# Altium schematic sheet Tag_Lastmodulation_Primär.SchDoc
size A4; SheetNumber: 8; SheetTotal: 8
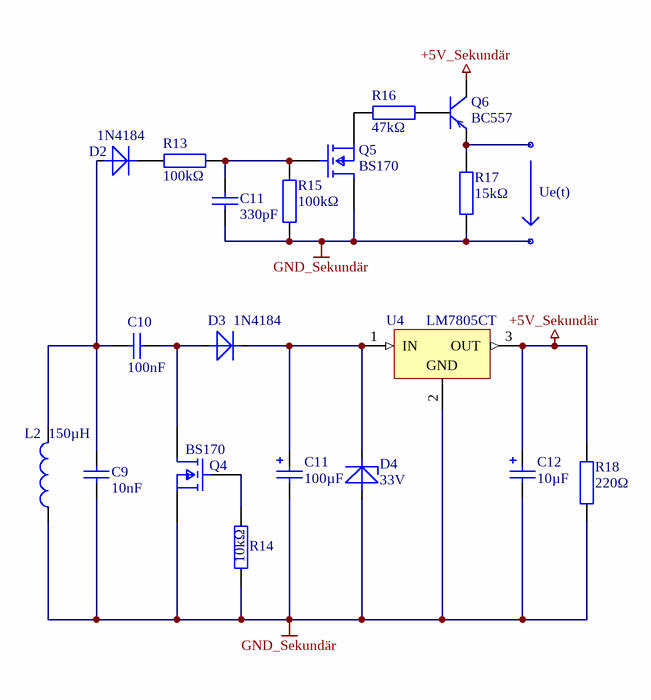
[diagram p0: Tag_Lastmodulation_Primär.SchDoc]

## Parts
(Parts that share a designator on the sheet are numbered #1, #2 ... from top to bottom, then left to right.)
*  Ue(t)
C9  value 10nF  [rad-7.2/2.5/5]  (hidden comment: KO)
C10  value 100nF  [rad-7.2/2.5/5]  (hidden comment: KO)
C11#1  value 330pF  [rad-7.2/2.5/5]  (hidden comment: KO)
C11#2  value 100µF  [RB-.1/.2]  (hidden comment: ELKO)
C12  value 10µF  [RB-.1/.2]  (hidden comment: ELKO)
D2  1N4184  [DIODE-0.6]
D3  1N4184  [DIODE-0.6]
D4  33V  [DIODE-0.4]
L2  value 150µH  (hidden comment: Inductor)
Q4  BS170  [FP-SOT23-IPC_A]
Q5  BS170  [FP-SOT23-IPC_A]
Q6  BC557  [TO-92/EBC]
R13  value 100kΩ  [Axial-0.4]  (hidden comment: RES)
R14  value 10kΩ  [Axial-0.4]  (hidden comment: RES)
R15  value 100kΩ  [Axial-0.4]  (hidden comment: RES)
R16  value 47kΩ  [Axial-0.4]  (hidden comment: RES)
R17  value 15kΩ  [Axial-0.4]  (hidden comment: RES)
R18  value 220Ω  [Axial-0.4]  (hidden comment: RES)
U4  LM7805CT  [FAIR-TO-220-3]

## Nets
+5V_Sekundär: C12.1 Q6.3(C) R18.2 U4.3(OUT)
GND_Sekundär: C9.1 C11#1.2 C11#2.2 C12.2 D4.1(A) L2.2 Q4.2(S) Q5.3(D) R14.1 R15.2 R17.2 R18.1 U4.2(GND)
NetC9_2: C9.2 C10.2 D2.1(A) L2.1
NetC10_1: C10.1 D3.1(A) Q4.3(D)
NetC11#1_1: C11#1.1 Q5.G1(G) R13.1 R15.1
NetC11#2_1: C11#2.1 D3.2(K) D4.2(K) U4.1(IN)
NetD2_2: D2.2(K) R13.2
NetQ4_G1: Q4.G1(G) R14.2
NetQ5_2: Q5.2(S) R16.2
NetQ6_1: Q6.1(B) R16.1
NetQ6_2: Q6.2(E) R17.1

## Library data of the parts
* = Spannungs_kleiner
C9 C10 C11#1 = KO: Kondensator
D2 D3 = DIODE
D4 = Z-DIODE
L2 = Inductor: SimulationGenericComponent: True
Q4 Q5 = CMP-12801-000064-2: MOSFET N-CH 60V .15MA SOT23-3; On-State Resistance: 5R; Continuous Drain Current (ID): 150mA; Threshold Voltage: 3V; Number of Channels: 1; Gate to Source Voltage (Vgs): 20V; Turn-On Delay Time: 10ns; Power Dissipation: 330mW; Element Configuration: Single; Input Capacitance: 60pF; Weight: 0.000282oz; Height: 1mm; Max Operating Temperature: 150°C; Dual Supply Voltage: 60V; Termination: SMD/SMT; Number of Pins: 3; Number of Elements: 1; Mount: Surface Mount; Min Operating Temperature: -55°C; Nominal Vgs: 3V; Width: 1.4mm; Drain to Source Breakdown Voltage: 60V; Turn-Off Delay Time: 10ns; Case/Package: SOT-23; REACH SVHC: No SVHC; Packaging: Tape and Reel; Length: 3.05mm; Max Power Dissipation: 330mW; Rds On Max: 5R; Lead Free: Lead Free; Contact Plating: Tin; Drain to Source Resistance: 5R; Drain to Source Voltage (Vdss): 60V; Package Quantity: 3000; Current Rating: 150mA; Voltage Rating (DC): 60V
Q6 = PNP: Transistor
R13-R18 = RES: Widerstand
U4 = CMP-2000-04938-1: Positive Voltage Regulator, 5 V, 1 A, -40 to 125 degC, 3-Pin TO-220, RoHS, Tube; Manufacturer: FairchildSemiconductor; Maximum Input Voltage: 35V; Maximum Quiescent Current: 8mA; Load Regulation: 100mV; Maximum Output Current: 2.2(Typ)A; Output Type: Fixed; Typical Dropout Voltage @ Current: 2@1AV; Rad Hard: No; Output Voltage: 5V; Accuracy: ±4%; Number of Outputs: 1; Category: LinearRegulator; Package Description: 3-Pin Through Hole Device, Body 10 x 4.5 mm, Pitch 2.54 mm; Packaging: Rail/Tube; Mounting: ThroughHole; Polarity: Positive; Manufacturer URL: https://www.fairchildsemi.com/; Line Regulation: 100mV; Datasheet Version: Aug-12; Datasheet URL: https://datasheet.ciiva.com/26904/lm7805ct-26904988.pdf; Package Reference: TO-220; Package URL: https://www.fairchildsemi.com/package-drawings/TO/TO220B03.pdf; Package: 3TO-220AB; Operating Temperature: -40to125degC; Type: Linear